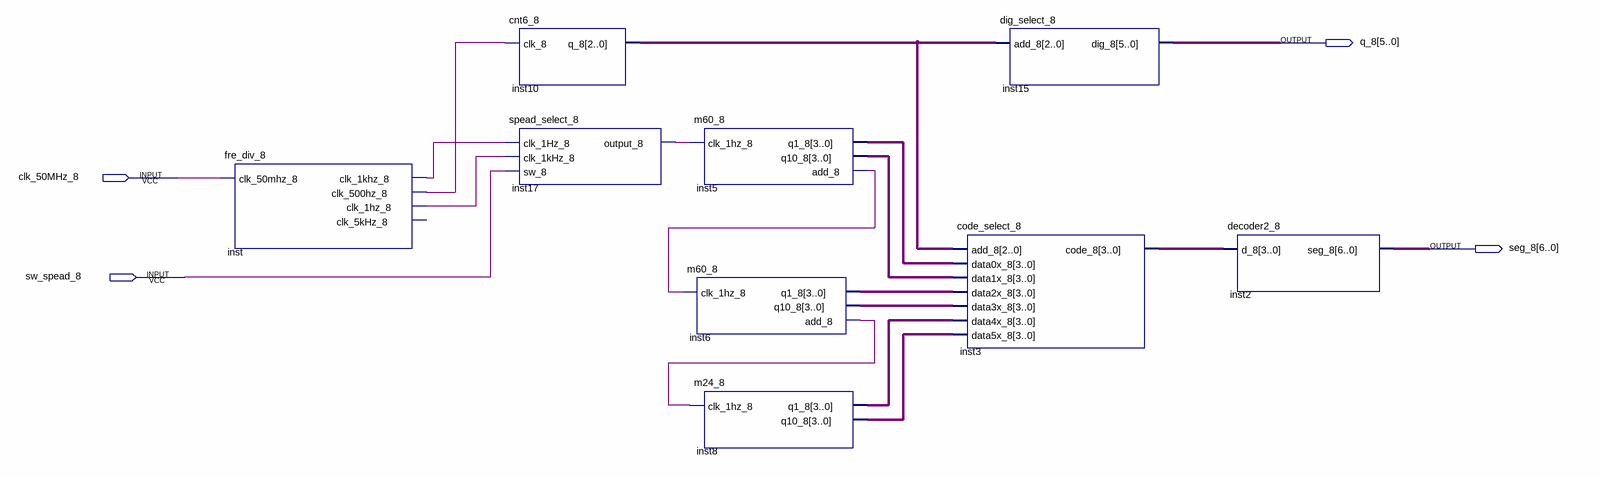
[diagram p0: schematic sheet]
// Quartus schematic jc_8.bdf as structural Verilog: 9 symbols, 4 pins
module jc_8 (
  input  clk_50MHz_8,
  input  sw_spead_8,
  output [5:0] q_8,
  output [6:0] seg_8
);

  wire inst5_add_8, inst6_add_8, inst17_output_8, inst_clk_1hz_8, inst_clk_1khz_8, inst_clk_500hz_8;
  wire [2:0] inst10_q_8;
  wire [3:0] inst3_code_8, inst5_q1_8, inst5_q10_8, inst6_q1_8, inst6_q10_8, inst8_q1_8, inst8_q10_8;

  fre_div_8 inst (
    .clk_50mhz_8(clk_50MHz_8), .clk_1khz_8(inst_clk_1khz_8), .clk_500hz_8(inst_clk_500hz_8),
    .clk_1hz_8(inst_clk_1hz_8));  // open: clk_5kHz_8
  cnt6_8 inst10 (.clk_8(inst_clk_500hz_8), .q_8(inst10_q_8));
  spead_select_8 inst17 (
    .clk_1Hz_8(inst_clk_1khz_8), .clk_1kHz_8(inst_clk_1hz_8), .sw_8(sw_spead_8), .output_8(inst17_output_8));
  m60_8 inst5 (.clk_1hz_8(inst17_output_8), .q1_8(inst5_q1_8), .q10_8(inst5_q10_8), .add_8(inst5_add_8));
  m60_8 inst6 (.clk_1hz_8(inst5_add_8), .q1_8(inst6_q1_8), .q10_8(inst6_q10_8), .add_8(inst6_add_8));
  m24_8 inst8 (.clk_1hz_8(inst6_add_8), .q1_8(inst8_q1_8), .q10_8(inst8_q10_8));
  code_select_8 inst3 (
    .add_8(inst10_q_8), .data0x_8(inst5_q1_8), .data1x_8(inst5_q10_8), .data2x_8(inst6_q1_8),
    .data3x_8(inst6_q10_8), .data4x_8(inst8_q1_8), .data5x_8(inst8_q10_8), .code_8(inst3_code_8));
  dig_select_8 inst15 (.add_8(inst10_q_8), .dig_8(q_8));
  decoder2_8 inst2 (.d_8(inst3_code_8), .seg_8(seg_8));
endmodule
